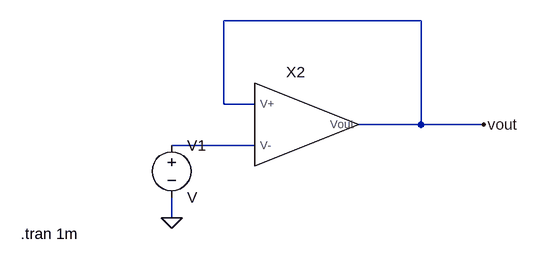
[diagram p0: schematic Voltage_Follower.asc]
Voltage_Follower.asc, the LTspice schematic file:
Version 4
SHEET 1 880 680
WIRE 336 16 32 16
WIRE 32 144 32 16
WIRE 80 144 32 144
WIRE 336 176 336 16
WIRE 336 176 240 176
WIRE 432 176 336 176
WIRE 80 208 -48 208
WIRE -48 320 -48 288
FLAG -48 320 0
FLAG 432 176 vout
SYMBOL MY_IDEAL_opamp 144 176 R0
SYMATTR InstName X2
SYMBOL voltage -48 192 R0
SYMATTR InstName V1
TEXT -280 344 Left 2 !.tran 1m

The netlist it stands for:
* Voltage_Follower.asc
XX2 vout N001 vout MY_IDEAL_opamp  ; pins V+ V- Vout
V1 N001 0 V
.tran 1m
.backanno
.end